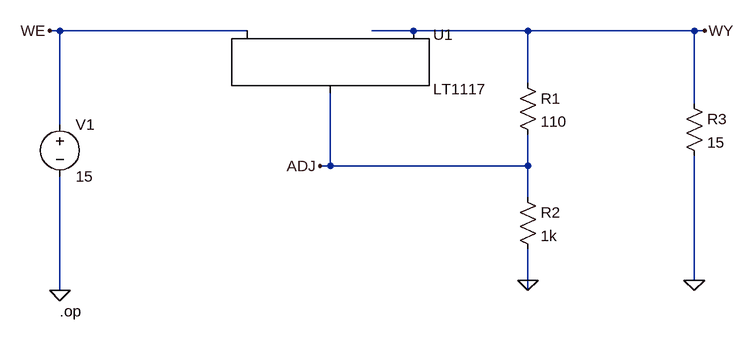
[diagram p0: schematic LT1117.asc]
LT1117.asc, the LTspice schematic file:
Version 4.1
SHEET 1 880 680
WIRE -192 144 -208 144
WIRE 96 144 -192 144
WIRE 352 144 288 144
WIRE 528 144 352 144
WIRE 784 144 528 144
WIRE 800 144 784 144
WIRE 528 224 528 144
WIRE 784 256 784 144
WIRE -192 288 -192 144
WIRE 224 352 224 240
WIRE 224 352 208 352
WIRE 528 352 528 304
WIRE 528 352 224 352
WIRE 528 400 528 352
WIRE 528 528 528 480
WIRE 784 528 784 336
WIRE -192 544 -192 368
WIRE 528 544 528 528
FLAG 528 528 0
FLAG -192 544 0
FLAG 784 528 0
FLAG 800 144 WY
FLAG 208 352 ADJ
FLAG -208 144 WE
SYMBOL PowerProducts\\LT1117 224 144 R0
SYMATTR InstName U1
SYMBOL res 512 208 R0
SYMATTR InstName R1
SYMATTR Value 110
SYMBOL res 512 384 R0
SYMATTR InstName R2
SYMATTR Value 1k
SYMBOL voltage -192 272 R0
WINDOW 123 0 0 Left 0
WINDOW 39 0 0 Left 0
SYMATTR InstName V1
SYMATTR Value 15
SYMBOL res 768 240 R0
SYMATTR InstName R3
SYMATTR Value 15
TEXT -192 576 Left 2 !.op

The netlist it stands for:
* LT1117.asc
X§U1 ADJ WY WE LT1117
R1 WY ADJ 110
R2 ADJ 0 1k
V1 WE 0 15
R3 WY 0 15
.op
.lib LT1117.lib
.backanno
.end